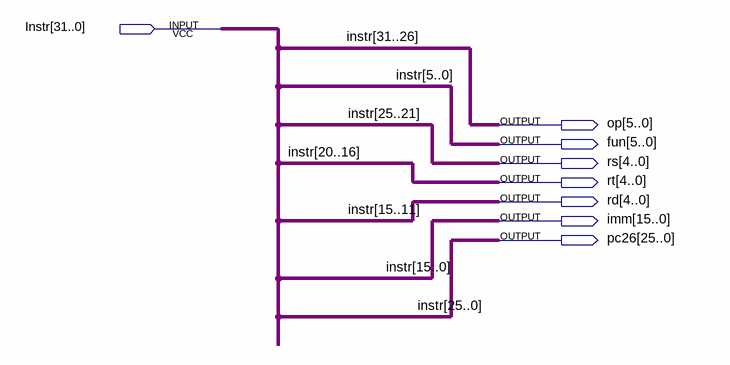
[diagram p0: schematic sheet]
// Quartus schematic split.bdf as structural Verilog: 0 symbols, 8 pins
module split (
  input  [31:0] Instr,
  output [5:0] op,
  output [5:0] fun,
  output [4:0] rs,
  output [4:0] rt,
  output [4:0] rd,
  output [15:0] imm,
  output [25:0] pc26
);


  assign fun = Instr[5:0];
  assign imm = Instr[15:0];
  assign op = Instr[31:26];
  assign pc26 = Instr[25:0];
  assign rd = Instr[15:11];
  assign rs = Instr[25:21];
  assign rt = Instr[20:16];
endmodule
